# EAGLE design dataLogger-TR (EAGLE 6.4)
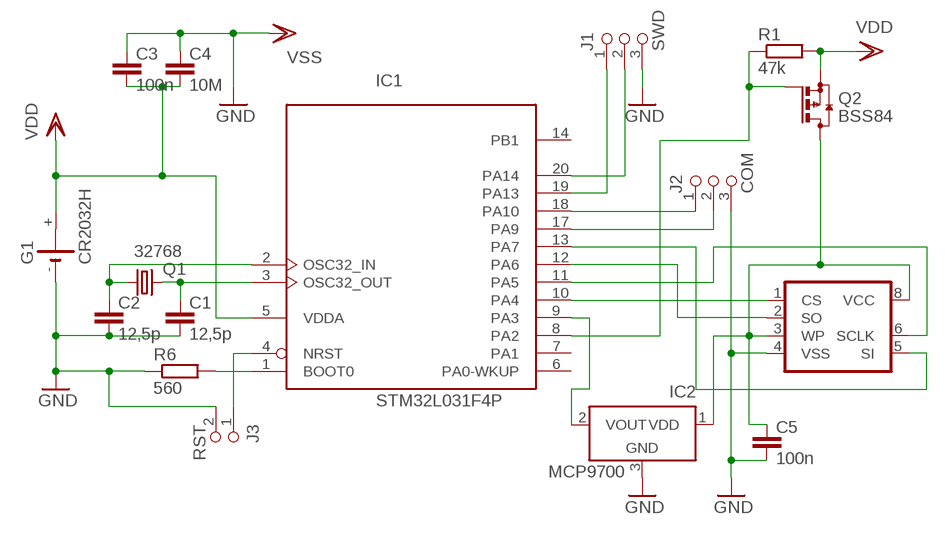
[diagram p0: schematic, sheet 1]

## Parts
C1  12,5p  C0805  [0805]
C2  12,5p  C0805  [0805]
C3  100n  C0805  [0805]
C4  10M  C0805  [0805]
C5  100n  C0805  [0805]
G1  CR2032H  [CR2032H]
IC1  STM32L031F4P  [TSSOP20-I]
IC2  MCP9700  [SOT23]
J1  SWD  CON1X3HEAD1X3I  [HEAD1X3I]
J2  COM  CON1X3HEAD1X3I  [HEAD1X3I]
J3  RST  CON1X2HEAD1X2I  [HEAD1X2I]
Q1  32768  CRYSTALTC38H-SMD  [TC38H-SMD]
Q2  BSS84  [SOT23]
R1  47k  R-EU_R0805  [R0805]
R6  560  R-EU_R0805  [R0805]
U$1  GD25  GD25SO08  [SO08]

## Nets
GND: C1.2 C2.2 C3.1 C4.1 C5.2 G1.- IC2.3(GND) J1.3 J2.3 J3.2 R6.1 U$1.4(VSS) ; supply symbol labelled VSS
N$1: IC1.1(BOOT0) R6.2
N$2: IC1.4(NRST) J3.1
N$3: IC1.10(PA4) U$1.1(CS)
N$4: IC1.20(PA14) J1.2
N$5: IC1.19(PA13) J1.1
N$6: IC1.18(PA10) J2.1
N$7: IC1.17(PA9) J2.2
N$8: IC1.8(PA2) Q2.1(G) R1.1
N$9: IC1.11(PA5) U$1.6(SCLK)
N$10: IC1.13(PA7) U$1.5(SI)
N$11: IC1.12(PA6) U$1.2(SO)
N$12: IC1.9(PA3) IC2.2(VOUT)
N$14: C2.1 IC1.2(OSC32_IN) Q1.P$1
N$16: C1.1 IC1.3(OSC32_OUT) Q1.P$2
N$17: C5.1 IC2.1(VDD) Q2.3(D) U$1.3(WP) U$1.8(VCC)
VDD: C3.2 C4.2 G1.+ IC1.5(VDDA) Q2.2(S) R1.2
Unconnected: G1.+@1(+) IC1.6(PA0-WKUP) IC1.7(PA1) IC1.14(PB1)

## Power pins joined to a net without a drawn wire
GND: IC1.15(VSS)
VDD: IC1.16(VDD)

## Library data of the parts
C1-C5 = cdrt:C: Kondenzator
G1 = Vladicek:CR2032H: LI BATTERY Varta
IC1 = Vladicek:STM32L031F*P: ARM 32-bit Cortex™-M0+ CPU 32 MHz maximum frequency 16 Kbytes of Flash memory 8 kbytes of SRAM 15 GPIOs 1.65 to 3.6 V application supply
IC2 = Vladicek:MCP9700: SOT-23 Low-Power Linear Active Thermistor
J1 J2 = conect:CON1X3: Konektor 3 piny
J3 = conect:CON1X2: Konektor 2 piny
Q1 = Vladicek:CRYSTAL: CRYSTAL
Q2 = transistor-small-signal:BSS84: P-CHANNEL MOS FET
R1 R6 = rcl:R-EU_: RESISTOR, European symbol
U$1 = Vladicek:GD25

## Board
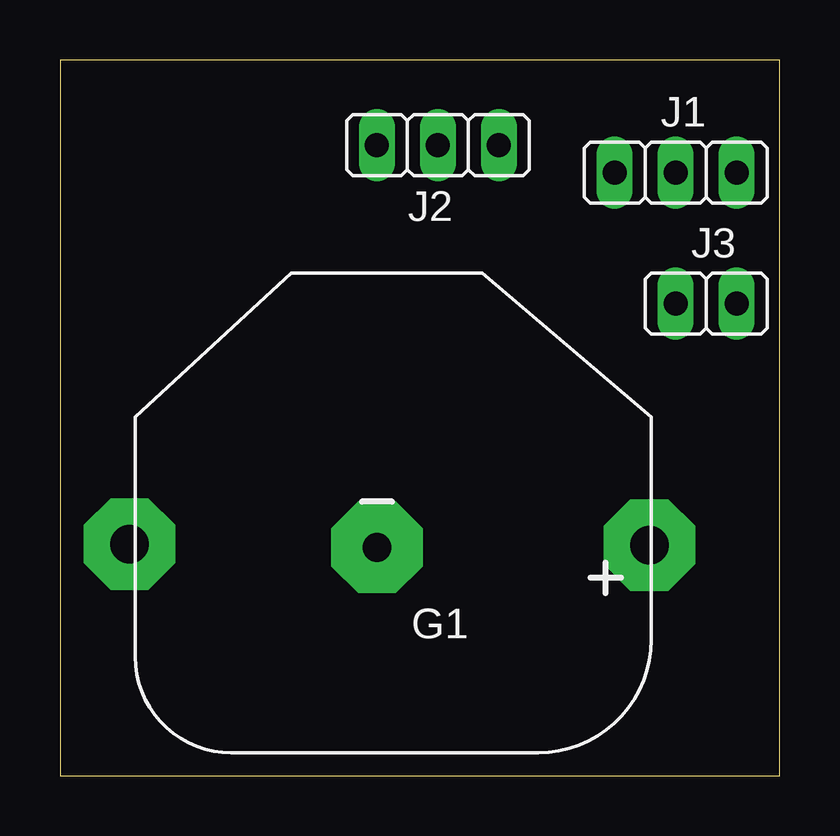
[diagram p1: board, top side]
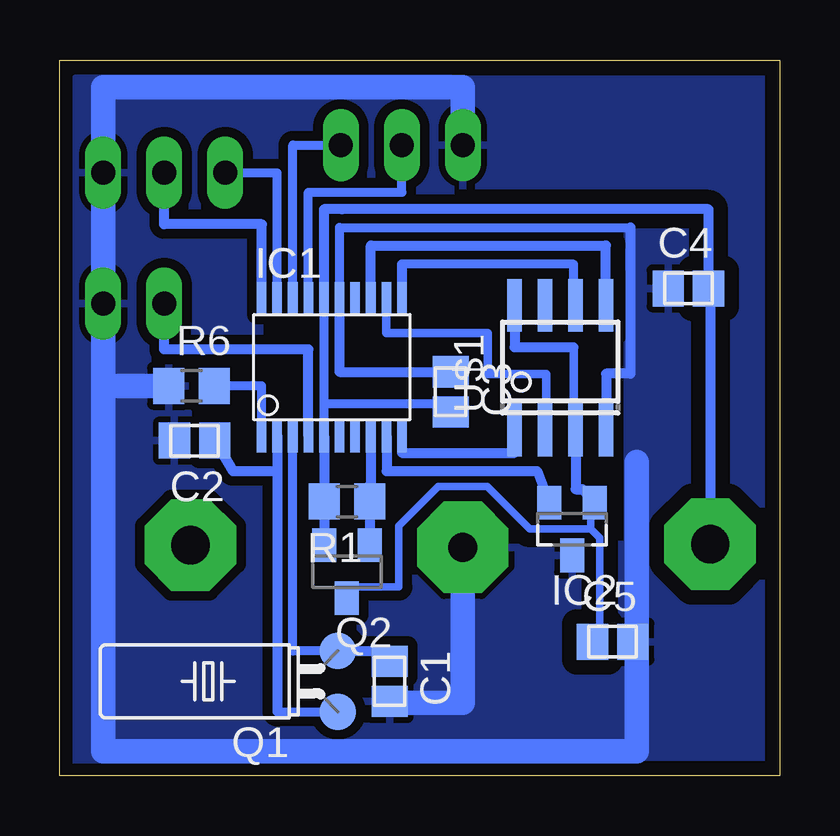
[diagram p2: board, bottom side, seen from below]

Size 29.99 x 29.84 mm. Coordinates in mm from the lower left corner, seen from the top.
Outline: 0,0 29.99,0 29.99,29.84 0,29.84 0,0
Copper layers (1+16): Top 0.035mm / dielectric 1.5mm / Bottom 0.035mm
Design rules "default *": minimum track width 10mil, minimum drill 24mil, track to track 8mil, track to pad 8mil, pad to pad 8mil, via to via 8mil, smd to smd 8mil, copper to edge 20mil, drill to drill 8mil, minimum pad ring 10mil, minimum via ring 8mil, stop-mask expansion 4mil, vias tented up to drill 0mil, thermal gap 10mil

### Footprints (pad centres in the part's own frame; a part is rotated, then mirrored left to right if it is on the bottom)
0805 = smd 1.3 x 1.5: 1 -0.838,0; 2 0.838,0
CR2032H = drill 1.6 pad 3.81 octagon: + 10.31,0.5; +@1 -11.35,0.54 | drill 1.2 pad 3.81 octagon: - 0,0.635
TSSOP20-I = smd 0.4 x 1.35: 1 -2.925,-2.875; 2 -2.275,-2.875; 3 -1.625,-2.875; 4 -0.975,-2.875; 5 -0.325,-2.875; 6 0.325,-2.875; 7 0.975,-2.875; 8 1.625,-2.875; 9 2.275,-2.875; 10 2.925,-2.875; 11 2.925,2.875; 12 2.275,2.875; 13 1.625,2.875; 14 0.975,2.875; 15 0.325,2.875; 16 -0.325,2.875; 17 -0.975,2.875; 18 -1.625,2.875; 19 -2.275,2.875; 20 -2.925,2.875
SOT23 = smd 1 x 1.4: 1 -0.95,-1.1; 2 0.95,-1.1; 3 0,1.1
HEAD1X3I = drill 1 long: 1 -2.54,0; 2 0,0; 3 2.54,0
HEAD1X2I = drill 1 long: 1 -1.27,0; 2 1.27,0
TC38H-SMD = smd 1.524 x 1.524: P$1 -1.27,0; P$2 1.27,0
R0805 = smd 1.3 x 1.5: 1 -0.95,0; 2 0.95,0
SO08 = smd 0.6 x 2.2: 1 -1.905,-2.6; 2 -0.635,-2.6; 3 0.635,-2.6; 4 1.905,-2.6; 5 1.905,2.6; 6 0.635,2.6; 7 -0.635,2.6; 8 -1.905,2.6

### Placement (x,y rotation side)
C1  16.26,3.94 270 bottom
C2  24.38,13.97 180 bottom
C3  13.72,16 270 bottom
C4  3.81,20.32 0 bottom
C5  6.96,5.59 0 bottom
G1  13.21,10.16 180 top
IC1  18.67,17.03 0 bottom
IC2  8.65,10.29 180 bottom
J1  25.65,25.15 0 top
J2  15.75,26.29 180 top
J3  26.92,19.68 0 top
Q1  18.41,3.94 90 bottom
Q2  18.03,8.51 180 bottom
R1  18.03,11.43 180 bottom
R6  24.51,16.26 0 bottom
U$1  9.14,17.02 0 bottom

### Tracks (layer width: path | path; a pad name or v marks a point on that pad's centre or on a via)
GND
  Bottom 0.381: IC1.15 18.34,22.86 6.22,22.86
  Bottom 0.406: J3.2 28.19,20.07 | IC1.15 18.34,16.84 C3.1 | 13.21,9.65 G1.- | 6.22,22.86 6.22,16.76 7.24,16.76 U$1.4
  Bottom 1.016: 28.19,4.19 28.19,1.02 5.97,1.02 5.97,13.08 | 28.19,4.32 28.19,16.26 | 28.19,16.26 28.19,20.07 J1.3 28.19,28.7 13.21,28.7 J2.3 | R6.1 28.19,16.26 | G1.- 13.21,3.05 16.26,3.05 C1.2
  pour Bottom (isolate 0.61): 0.25,29.08 13.21,29.08 13.21,23.24 6.35,23.24 6.35,9.65 13.46,9.65 13.46,0.73 0.25,0.61
  pour Bottom (isolate 0.406): 13.72,29.08 29.34,29.08 29.34,0.6 13.72,0.6 13.59,0.76 13.59,9.14 21.59,9.14 21.72,23.62 13.72,23.62
N$1
  Bottom 0.381: IC1.1 21.59,16.26 R6.2
N$2
  Bottom 0.406: IC1.4 19.64,17.78 25.65,17.78 J3.1
N$3
  Bottom 0.406: IC1.10 15.74,13.46 11.05,13.46 U$1.1
N$4
  Bottom 0.406: IC1.20 21.58,22.99 25.65,22.99 J1.2
N$5
  Bottom 0.381: IC1.19 20.94,25.13 22.73,25.13 J1.1
N$6
  Bottom 0.381: IC1.18 20.29,26.29 | 20.29,26.3 20.29,26.29 | 20.29,26.29 J2.1
  Bottom 0.406: 18.92,26.3 J2.1
N$7
  Bottom 0.381: IC1.17 19.64,24.32 15.75,24.32 J2.2
N$8
  Bottom 0.305: IC1.8
  Bottom 0.406: IC1.8 17.04,12.16 17.08,12.12 R1.1 Q2.1
N$9
  Bottom 0.381: U$1.6 8.59,19.69 8.59,21.33 15.74,21.33
  Bottom 0.406: IC1.11 15.74,21.31 15.74,21.33
N$10
  Bottom 0.381: IC1.13
  Bottom 0.406: U$1.5 7.25,22.11 17.04,22.11 IC1.13
N$11
  Bottom 0.356: U$1.2 9.74,16.12 9.74,16.75 12.16,16.75 12.16,18.45 16.39,18.45 IC1.12
N$12
  Bottom 0.406: IC1.9 16.38,12.7 10.11,12.7 IC2.2
N$14
  Bottom 0.305: IC1.2
  Bottom 0.381: 20.93,2.67 Q1.P$1
  Bottom 0.406: IC1.2 20.93,12.7 | 20.93,12.7 20.93,2.67 | 18.41,2.73 Q1.P$1 | C2.1 22.78,12.7 20.93,12.7
N$16
  Bottom 0.381: Q1.P$2 20.29,5.21 IC1.3
  Bottom 0.406: Q1.P$2 16.26,5.21 C1.1
N$17
  Bottom 0.305: 18.03,7.87 15.88,7.87 15.88,10.41 14.22,12.06 12.19,12.06 10.41,10.29 7.87,10.29 | 7.87,11.51 7.87,10.29 | 7.87,10.29 7.49,9.91 7.49,6.1
  Bottom 0.356: 8.59,17.87 8.59,13.84 U$1.3
  Bottom 0.406: U$1.8 11.05,17.87 8.59,17.87 | Q2.3 18.03,7.87 | 8.59,13.84 8.51,13.84 8.51,11.94 8.21,11.94 IC2.1 | IC2.1 7.55,11.51 | 7.49,5.59 C5.1 7.8,5.79 7.49,6.1 | IC2.1 7.87,11.51
VDD
  Bottom 0.305: IC1.5
  Bottom 0.381: IC1.16 18.99,15.49 | 18.99,15.49 IC1.5 | C3.2 14.05,15.49 18.99,15.49
  Bottom 0.406: IC1.16 18.99,23.61 18.25,23.62 2.97,23.62 C4.2 2.9,20.32 G1.+ | C3.2 13.34,15.29 13.34,15.62 | Q2.2 R1.2 IC1.5
  Bottom 1.016: G1.+